# EAGLE design ext_board (EAGLE 7.4.0)
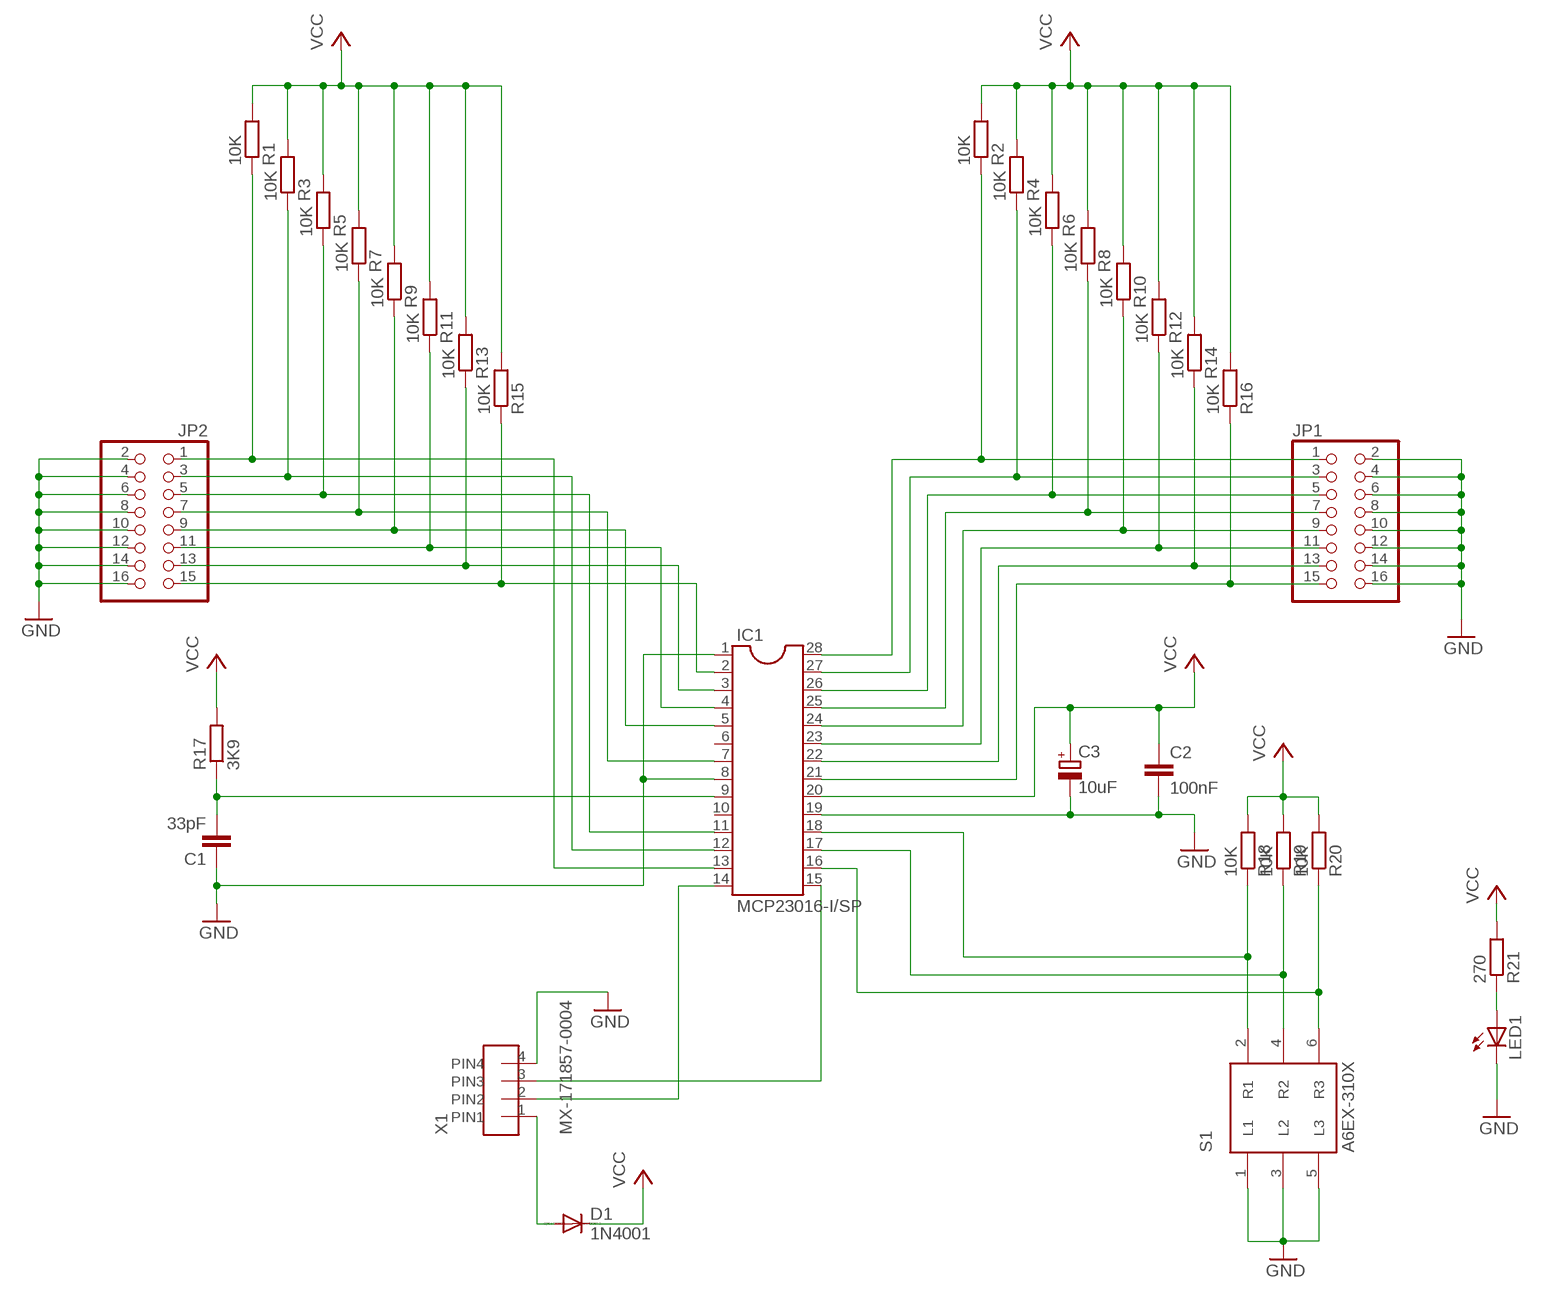
[diagram p0: schematic, sheet 1]

## Parts
C1  33pF  C-EU050-030X075  [C050-030X075]
C2  100nF  C-EU050-030X075  [C050-030X075]
C3  10uF  CPOL-EUE2.5-7  [E2,5-7]
D1  1N4001  1N4004  [DO41-10]
IC1  MCP23016-I/SP  DIL28-3  [DIL28-3]
JP1  PINHD-2X8  [2X08]
JP2  PINHD-2X8  [2X08]
LED1  LED3MM  [LED3MM]
R1  10K  R-EU_0204/7  [0204/7]
R2  10K  R-EU_0204/7  [0204/7]
R3  10K  R-EU_0204/7  [0204/7]
R4  10K  R-EU_0204/7  [0204/7]
R5  10K  R-EU_0204/7  [0204/7]
R6  10K  R-EU_0204/7  [0204/7]
R7  10K  R-EU_0204/7  [0204/7]
R8  10K  R-EU_0204/7  [0204/7]
R9  10K  R-EU_0204/7  [0204/7]
R10  10K  R-EU_0204/7  [0204/7]
R11  10K  R-EU_0204/7  [0204/7]
R12  10K  R-EU_0204/7  [0204/7]
R13  10K  R-EU_0204/7  [0204/7]
R14  10K  R-EU_0204/7  [0204/7]
R15  10K  R-EU_0204/7  [0204/7]
R16  10K  R-EU_0204/7  [0204/7]
R17  3K9  R-EU_0204/7  [0204/7]
R18  10K  R-EU_0204/7  [0204/7]
R19  10K  R-EU_0204/7  [0204/7]
R20  10K  R-EU_0204/7  [0204/7]
R21  270  R-EU_0204/7  [0204/7]
S1  A6EX-310X  [A6EX-310X]
X1  MX-171857-0004  [MX-171857-0004]

## Nets
GND: C1.1 C2.2 C3.- IC1.1 IC1.8 IC1.19 JP1.2 JP1.4 JP1.6 JP1.8 JP1.10 JP1.12 JP1.14 JP1.16 JP2.2 JP2.4 JP2.6 JP2.8 JP2.10 JP2.12 JP2.14 JP2.16 LED1.K(C) S1.1(L1) S1.3(L2) S1.5(L3) X1.4(PIN4)
GP0.0: IC1.21 JP1.15 R16.1
GP0.1: IC1.22 JP1.13 R14.1
GP0.2: IC1.23 JP1.11 R12.1
GP0.3: IC1.2 JP2.15 R15.1
GP0.4: IC1.3 JP2.13 R13.1
GP0.5: IC1.4 JP2.11 R11.1
N$1: C1.2 IC1.9 R17.1
N$2: IC1.18 R18.1 S1.2(R1)
N$3: IC1.17 R19.1 S1.4(R2)
N$4: IC1.5 JP2.9 R9.1
N$5: IC1.7 JP2.7 R7.1
N$6: D1.A X1.1(PIN1)
N$7: IC1.11 JP2.5 R5.1
N$11: IC1.16 R20.1 S1.6(R3)
N$13: IC1.24 JP1.9 R10.1
N$14: IC1.25 JP1.7 R8.1
N$15: IC1.26 JP1.5 R6.1
N$16: IC1.27 JP1.3 R4.1
N$17: IC1.28 JP1.1 R2.1
N$23: IC1.12 JP2.3 R3.1
N$24: IC1.13 JP2.1 R1.1
N$33: LED1.A R21.1
SCL: IC1.14 X1.2(PIN2)
SDA: IC1.15 X1.3(PIN3)
VCC: C2.1 C3.+ D1.C IC1.20 R1.2 R2.2 R3.2 R4.2 R5.2 R6.2 R7.2 R8.2 R9.2 R10.2 R11.2 R12.2 R13.2 R14.2 R15.2 R16.2 R17.2 R18.2 R19.2 R20.2 R21.2
Unconnected: IC1.6 IC1.10

## Library data of the parts
C1 = resistor:C-EU: CAPACITOR, European symbol; TME_CODE: FKP2-33P/1000-R
C2 = resistor:C-EU: CAPACITOR, European symbol; TME_CODE: CC-100N
C3 = rcl:CPOL-EU: POLARIZED CAPACITOR, European symbol; TME_CODE: UPW2A100MED
D1 = diode:1N4004: DIODE general purpose rectifier, 1 A; TME_CODE: 1N4001
IC1 = ic-package:DIL28: Dual In Line; TME_CODE: MCP23016-I/SP
JP1 JP2 = pinhead:PINHD-2X8: PIN HEADER; TME_CODE: 826632-8
LED1 = led:LED: LED OSRAM: - CHIPLED LG R971, LG N971, LY N971, LG Q971, LY Q971, LO R971, LY R971 LH N974, LH R974 LS Q976, LO Q976, LY Q976 LO Q996 - Hyper CHIPLED LW Q18S LB Q993, LB Q99A, LB R99A - SideLED LS A670, LO A670, LY A670, LG A670, LP A670 LB A673, LV A673, LT A673, LW A673 LH A674 LY A675 LS A676, LA A676, LO A676, LY A676, LW A676 LS A679, LY A679, LG A679 - Hyper Micro SIDELED® LS Y876, LA Y876, LO Y876, LY Y876 LT Y87S - SmartLED LW L88C, LW L88S LB L89C, LB L89S, LG L890 LS L89K, LO L89K, LY L89K LS L896, LA L896, LO L896, LY L896 - TOPLED LS T670, LO T670, LY T670, LG T670, LP T670 LSG T670, LSP T670, LSY T670, LOP T670, LYG T670 LG T671, LOG T671, LSG T671 LB T673, LV T673, LT T673, LW T673 LH T674 LS T676, LA T676, LO T676, LY T676, LB T676, LH T676, LSB T676, LW T676 LB T67C, LV T67C, LT T67C, LS T67K, LO T67K, LY T67K, LW E67C LS E67B, LA E67B, LO E67B, LY E67B, LB E67C, LV E67C, LT E67C LW T67C LS T679, LY T679, LG T679 LS T770, LO T770, LY T770, LG T770, LP T770 LB T773, LV T773, LT T773, LW T773 LH T774 LS E675, LA E675, LY E675, LS T675 LS T776, LA T776, LO T776, LY T776, LB T776 LHGB T686 LT T68C, LB T68C - Hyper Mini TOPLED® LB M676 - Mini TOPLED Santana® LG M470 LS M47K, LO M47K, LY M47K Source: http://www.osram.convergy.de LUXEON: - LUMILED® LXK2-PW12-R00, LXK2-PW12-S00, LXK2-PW14-U00, LXK2-PW14-V00 LXK2-PM12-R00, LXK2-PM12-S00, LXK2-PM14-U00 LXK2-PE12-Q00, LXK2-PE12-R00, LXK2-PE12-S00, LXK2-PE14-T00, LXK2-PE14-U00 LXK2-PB12-K00, LXK2-PB12-L00, LXK2-PB12-M00, LXK2-PB14-N00, LXK2-PB14-P00, LXK2-PB14-Q00 LXK2-PR12-L00, LXK2-PR12-M00, LXK2-PR14-Q00, LXK2-PR14-R00 LXK2-PD12-Q00, LXK2-PD12-R00, LXK2-PD12-S00 LXK2-PH12-R00, LXK2-PH12-S00 LXK2-PL12-P00, LXK2-PL12-Q00, LXK2-PL12-R00 Source: www.luxeon.com KINGBRIGHT: KA-3528ASYC Source: www.kingbright.com; TME_CODE: L-934ID
R1-R16 R18-R20 = resistor:R-EU_: RESISTOR, European symbol; TME_CODE: CF1/2WS-10K
R17 = resistor:R-EU_: RESISTOR, European symbol; TME_CODE: 1/4W3.9K
R21 = resistor:R-EU_: RESISTOR, European symbol; TME_CODE: CF1/2WS-270R
S1 = omron_dip_switch:A6EX-310X: OMRON Slide/Piano DIP Switch DIP Switch with a variety of assortment of Poles and Actuators in Slide or Piano Types. Source: http://www.tme.eu/en/Document/c2660313fae264cf6ac8383102742e6d/A6E_A6ER.PDF; TME_CODE: A6E-3104
X1 = con-molex-mx:MX-171857-0004; TME_CODE: MX-7395-04B

## Board
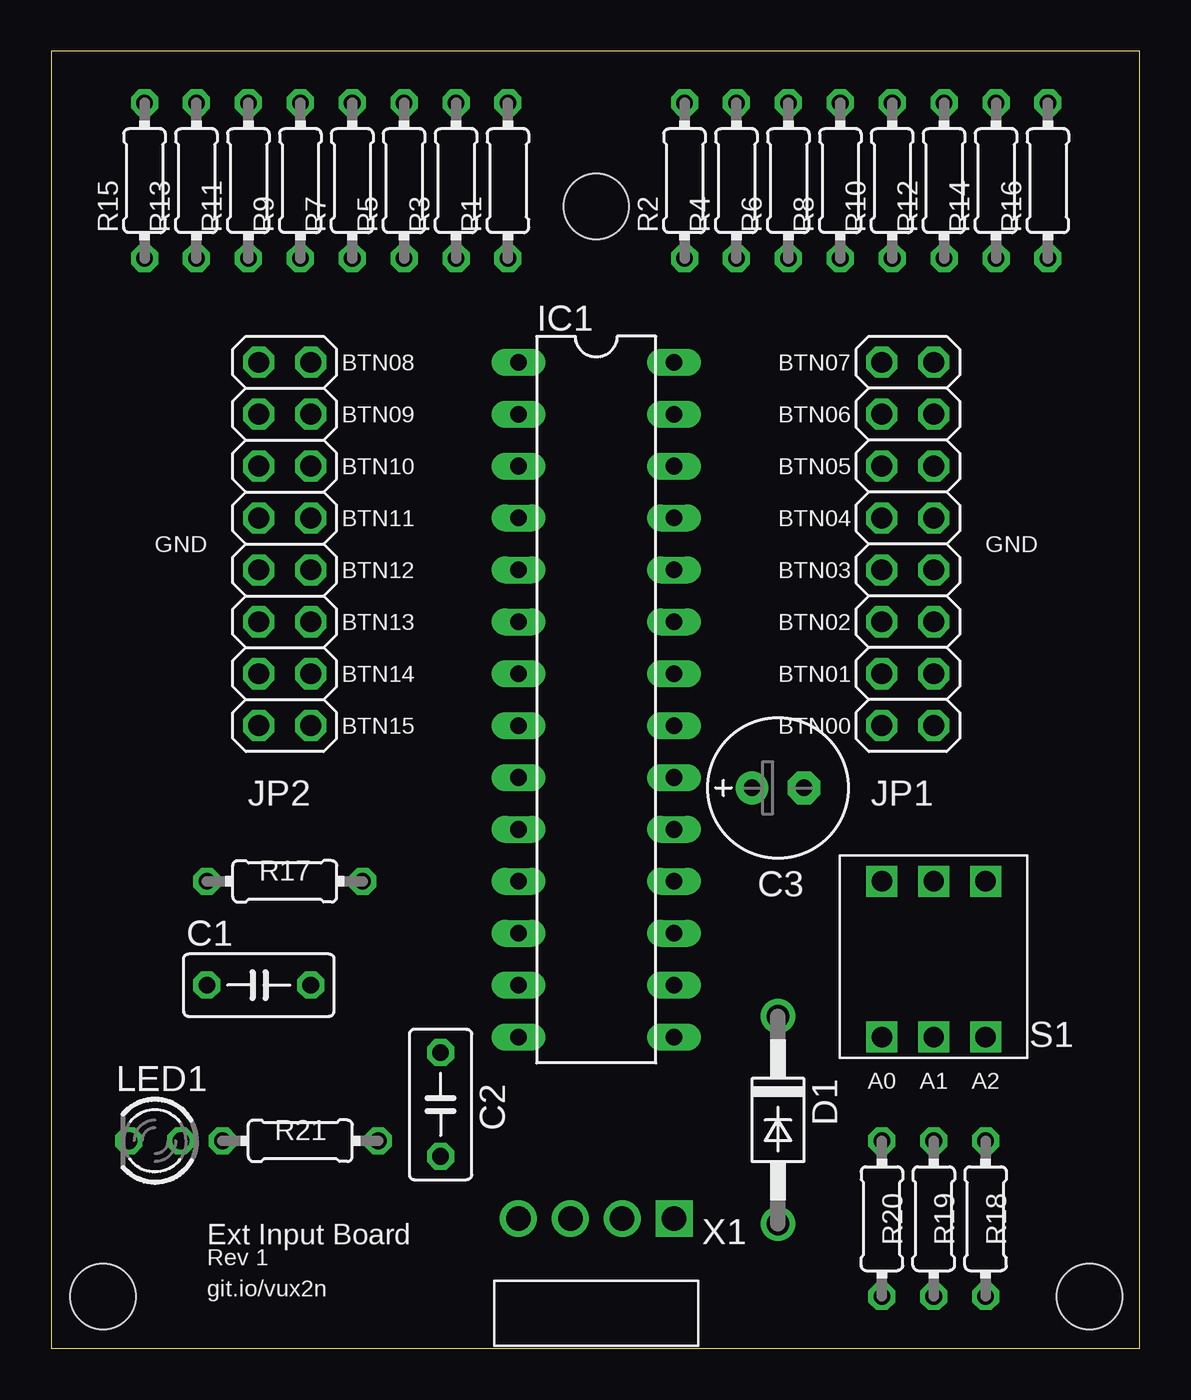
[diagram p1: board, top side]
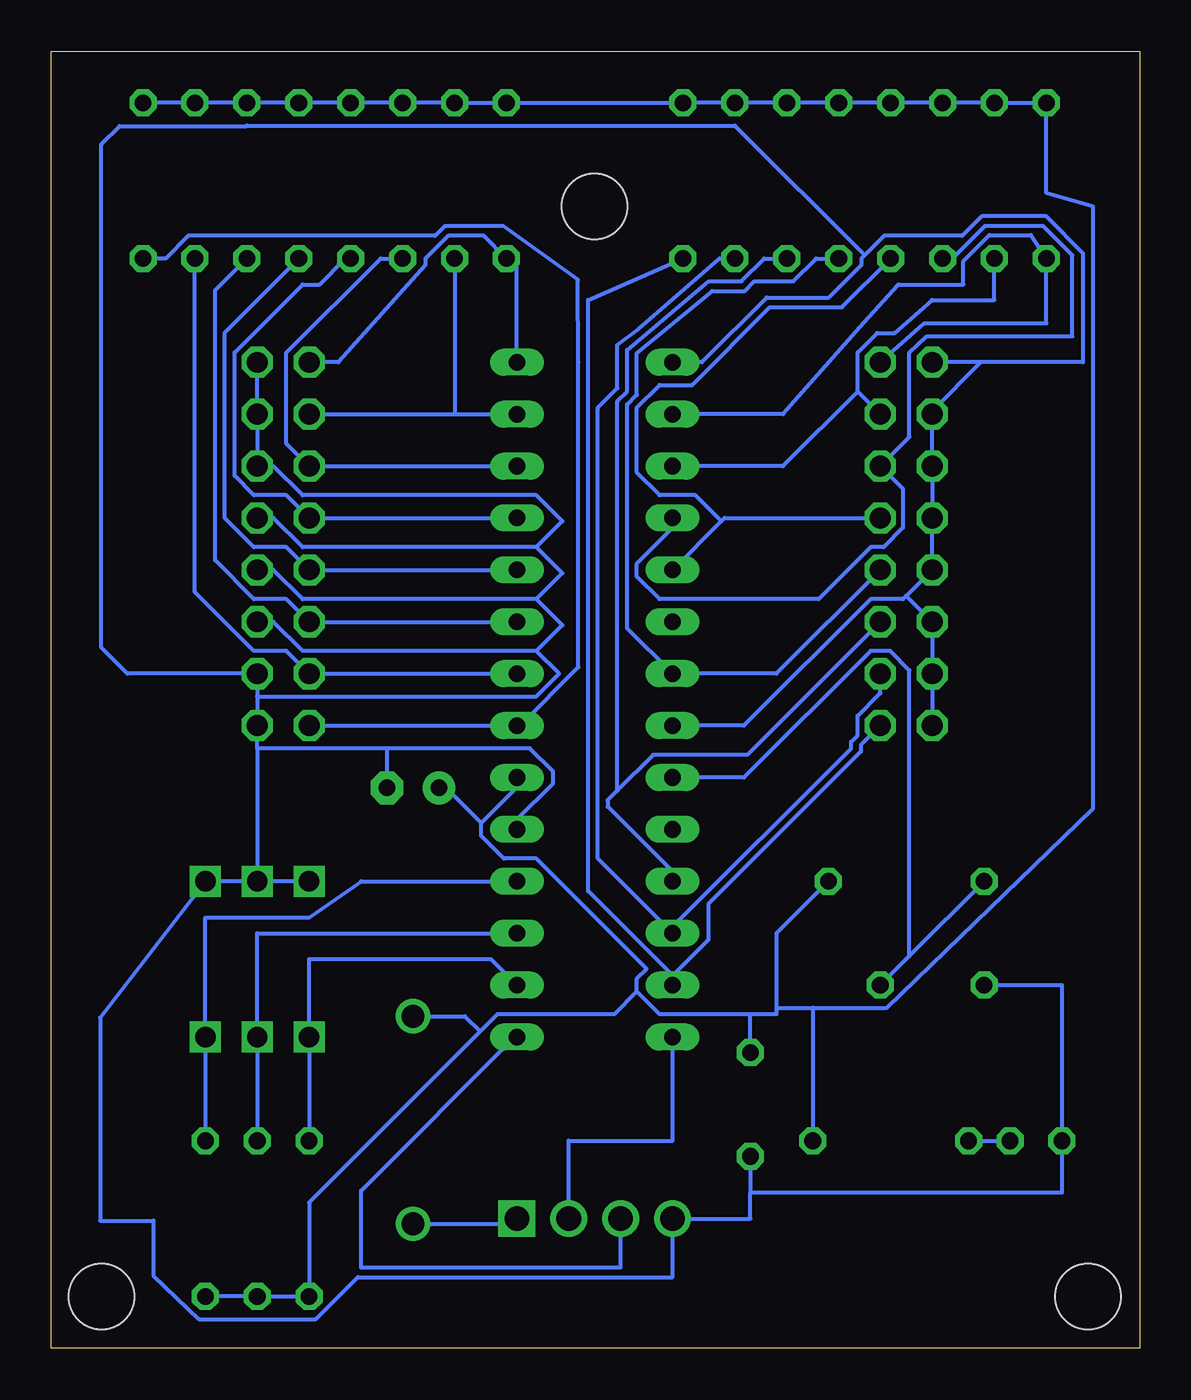
[diagram p2: board, bottom side, seen from below]

Size 53.26 x 63.49 mm. Coordinates in mm from the lower left corner, seen from the top.
Outline: 0,0 53.26,0 53.26,63.49 0,63.49 0,0
Copper layers (1*16): Top 0.035mm / dielectric 1.5mm / Bottom 0.035mm
Design rules "drukowane.pl": minimum track width 8mil, minimum drill 0.4mm, track to track 8mil, track to pad 8mil, pad to pad 8mil, via to via 8mil, smd to smd 8mil, copper to edge 40mil, drill to drill 8mil, minimum pad ring 10mil, minimum via ring 8mil, stop-mask expansion 4mil, vias tented up to drill 0mil, thermal gap 10mil
Holes 3.2 mm at 2.54,2.54 50.8,2.54 26.67,55.88

### Footprints (pad centres in the part's own frame; a part is rotated, then mirrored left to right if it is on the bottom)
C050-030X075 = drill 0.813 octagon: 1 -2.54,0; 2 2.54,0
E2,5-7 = drill 0.813 pad 1.6: + -1.27,0 | drill 0.813 pad 1.6 octagon: - 1.27,0
DO41-10 = drill 1.118: A 5.08,0; C -5.08,0
DIL28-3 = drill 0.813 long: 1 -16.51,-3.81; 2 -13.97,-3.81; 3 -11.43,-3.81; 4 -8.89,-3.81; 5 -6.35,-3.81; 6 -3.81,-3.81; 7 -1.27,-3.81; 8 1.27,-3.81; 9 3.81,-3.81; 10 6.35,-3.81; 11 8.89,-3.81; 12 11.43,-3.81; 13 13.97,-3.81; 14 16.51,-3.81; 15 16.51,3.81; 16 13.97,3.81; 17 11.43,3.81; 18 8.89,3.81; 19 6.35,3.81; 20 3.81,3.81; 21 1.27,3.81; 22 -1.27,3.81; 23 -3.81,3.81; 24 -6.35,3.81; 25 -8.89,3.81; 26 -11.43,3.81; 27 -13.97,3.81; 28 -16.51,3.81
2X08 = drill 1.016 octagon: 1 -8.89,-1.27; 2 -8.89,1.27; 3 -6.35,-1.27; 4 -6.35,1.27; 5 -3.81,-1.27; 6 -3.81,1.27; 7 -1.27,-1.27; 8 -1.27,1.27; 9 1.27,-1.27; 10 1.27,1.27; 11 3.81,-1.27; 12 3.81,1.27; 13 6.35,-1.27; 14 6.35,1.27; 15 8.89,-1.27; 16 8.89,1.27
LED3MM = drill 0.813 octagon: A -1.27,0; K 1.27,0
0204/7 = drill 0.813 octagon: 1 -3.81,0; 2 3.81,0
A6EX-310X = drill 1 square: 1 0,0; 2 0,7.62; 3 2.54,0; 4 2.54,7.62; 5 5.08,0; 6 5.08,7.62
MX-171857-0004 = drill 1.2 square: 1 0,0 | drill 1.2: 2 2.54,0; 3 5.08,0; 4 7.62,0

### Placement (x,y rotation side)
C1  10.16,17.78 0 top
C2  19.05,11.94 270 top
C3  35.56,27.43 0 top
D1  35.56,11.18 270 top
IC1  26.67,31.75 270 top
JP1  41.91,39.37 270 top
JP2  11.43,39.37 90 top
LED1  5.08,10.16 180 top
R1  22.35,57.15 90 top
R2  30.99,57.15 90 top
R3  19.81,57.15 90 top
R4  33.53,57.15 90 top
R5  17.27,57.15 90 top
R6  36.07,57.15 90 top
R7  14.73,57.15 90 top
R8  38.61,57.15 90 top
R9  12.19,57.15 90 top
R10  41.15,57.15 90 top
R11  9.65,57.15 90 top
R12  43.69,57.15 90 top
R13  7.11,57.15 90 top
R14  46.23,57.15 90 top
R15  4.57,57.15 90 top
R16  48.77,57.15 90 top
R17  11.43,22.86 0 top
R18  45.72,6.35 270 top
R19  43.18,6.35 270 top
R20  40.64,6.35 270 top
R21  12.19,10.16 0 top
S1  45.72,22.86 180 top
X1  30.48,6.35 180 top

### Tracks (layer width: path | path; a pad name or v marks a point on that pad's centre or on a via)
GND
  Bottom 0.203: IC1.1 21.43,48.26 18.26,51.44 15.21,51.44 13.62,53.02 13.62,53.34 13.46,53.5 | 13.46,53.5 12.51,54.45 8.7,54.45 7.75,55.4 4.57,55.4 2.79,53.59 2.79,48.26 7.78,48.26 | 7.78,48.26 10.16,45.88 JP2.14 JP2.12 JP2.10 JP2.8 11.43,36.83 | 7.78,48.26 JP2.16 | JP2.2 JP2.4 JP2.6 11.43,36.83 | IC1.8 19.37,30.48 13.18,36.67 11.59,36.67 11.43,36.83 | C1.1 3.81,17.78 LED1.K 3.81,7.62 19.05,7.62 | S1.5 S1.3 | S1.3 S1.1 50.86,16.19 50.86,6.25 48.26,6.25 48.26,3.56 46.04,1.43 40.32,1.43 38.26,3.49 22.86,3.49 X1.4 19.05,6.35 19.05,7.62 | JP1.2 JP1.4 JP1.6 42.39,43.18 40.96,41.75 29.53,41.75 28.26,40.48 29.53,39.21 | 43.18,31.91 JP1.14 49.53,33.02 50.8,34.29 50.8,58.93 49.91,59.82 43.72,59.82 43.69,59.85 19.81,59.85 13.46,53.5 | 43.18,31.91 JP1.16 43.18,29.37 | JP1.12 42.39,35.56 40.96,34.13 29.53,34.13 | 29.53,34.13 28.42,33.02 29.53,31.91 43.18,31.91 | JP1.10 42.39,38.1 40.96,36.67 29.53,36.67 | 29.53,36.67 28.26,35.4 29.53,34.13 | JP1.8 42.39,40.64 40.96,39.21 29.53,39.21 | 29.53,39.21 28.26,37.94 29.53,36.67 | 36.83,29.37 29.84,29.37 28.73,28.26 28.73,27.62 30.48,25.88 IC1.19 | 36.83,29.37 43.18,29.37 | 43.18,29.37 S1.3 | C2.2 19.05,7.62 | C3.- 36.83,29.37
GP0.0
  Bottom 0.203: JP1.15 IC1.21 30.32,30.48 27.46,33.34 27.46,48.26 27.5,52.29 31.15,54.93 34,54.93 34.48,54.45 46.55,54.45 47.66,53.34 R16.1
GP0.1
  Bottom 0.203: IC1.22 JP1.13 41.75,34.13 43.34,34.13 46.23,37.02 R14.1
GP0.2
  Bottom 0.203: IC1.23 JP1.11 41.75,36.67 43.34,36.67 45.24,38.58 45.24,51.78 R12.1
GP0.3
  Bottom 0.203: IC1.2 17.46,45.72 13.72,49.97 11.81,52.07 8.64,52.07 8.64,53.21 7.37,54.48 5.33,54.48 R15.1 4.57,50.16 10.54,50.16 JP2.15
GP0.4
  Bottom 0.203: 13.81,46.83 13.81,48.74 12.86,49.69 12,49.69 10.16,51.31 7.11,51.31 R13.1 | JP2.13 13.81,46.83 | IC1.3 17.46,43.18 13.81,46.83
GP0.5
  Bottom 0.203: IC1.4 22.86,40.16 24.61,38.42 24.61,37.78 23.5,36.67 15.72,36.67 13.18,39.21 12.54,39.21 11.59,40.16 11.59,42.07 JP2.11 11.27,44.61 11.27,48.74 10.41,49.53 3.3,49.53 3.3,53.5 4.73,54.93 7.59,54.93 9.18,53.34 R11.1
N$1
  Bottom 0.203: C1.2 11.27,19.21 | 11.27,19.21 R17.1 | IC1.9 19.37,27.94 13.18,34.13 12.22,34.13 11.27,33.18 11.27,19.21
N$2
  Bottom 0.203: IC1.18 38.1,22.86 40.64,21.08 45.72,21.08 S1.2 R18.1
N$3
  Bottom 0.203: R19.1 S1.4 43.18,20.32 IC1.17
N$4
  Bottom 0.203: 20.48,40.48 21.75,41.75 23.5,41.75 24.61,42.86 24.61,46.04 23.5,47.15 21.91,47.15 18.1,50.96 14.57,50.96 R9.1 | IC1.5 20.48,40.48 | JP2.9 20.32,40.64 20.48,40.48
N$5
  Bottom 0.203: JP2.7 17.78,33.02 IC1.7 25.08,35.24 25.08,46.2 24.61,46.67 24.61,48.7 20.92,51.75 19.34,51.75 18.86,52.23 16.95,52.23 15.84,53.34 R7.1
N$6
  Bottom 0.203: D1.A 30.48,6.1 X1.1
N$7
  Bottom 0.203: IC1.11 22.86,23.34 26.04,26.51 26.04,26.83 25.56,27.3 | 25.56,27.3 23.81,29.05 19.21,29.05 JP2.5 | R5.1 18.38,53.34 19.49,52.23 21.08,52.23 25.08,48.86 25.08,46.83 25.56,46.35 25.56,27.3
N$11
  Bottom 0.203: R20.1 S1.6 40.64,19.05 31.75,19.05 IC1.16
N$13
  Bottom 0.203: IC1.24 JP1.9 41.75,39.21 43.34,39.21 44.77,40.64 44.77,49.72 R10.1
N$14
  Bottom 0.203: IC1.25 JP1.7 41.75,41.75 43.34,41.75 44.29,42.7 44.29,48.74 40.96,52.07 40.13,52.07 38.86,53.34 R8.1
N$15
  Bottom 0.203: IC1.26 JP1.5 41.75,44.29 41.75,48.74 37.15,53.34 R6.1
N$16
  Bottom 0.203: JP1.3 IC1.27 33.53,45.72 R4.1
N$17
  Bottom 0.203: JP1.1 39.21,48.26 34.96,53.02 34.96,53.34 33.85,54.45 32.1,54.45 R2.1 30.48,53.34 IC1.28
N$23
  Bottom 0.203: 23.02,20.48 26.51,23.97 26.51,46.04 25.56,46.99 25.56,49.12 24.51,49.91 20.57,53.34 R3.1 | JP2.3 12.7,32.07 13.81,30.96 13.81,30 14.13,29.69 14.13,29.37 23.02,20.48 | 23.02,20.48 IC1.12
N$24
  Bottom 0.203: 22.86,18.26 21.11,20 21.11,21.75 13.65,29.21 13.65,29.53 JP2.1 | 22.86,18.26 26.99,22.38 26.99,51.31 R1.1 | 22.86,18.26 IC1.13
N$33
  Bottom 0.203: R21.1 LED1.A
SCL
  Bottom 0.203: X1.2 27.94,10.16 22.86,10.16 IC1.14
SDA
  Bottom 0.203: IC1.15 30.57,15.24 38.1,7.71 38.1,3.97 25.4,3.97 X1.3
VCC
  Bottom 0.203: R16.2 R14.2 R12.2 R10.2 R8.2 R6.2 R4.2 R2.2 R1.2 R3.2 R5.2 R7.2 R9.2 R11.2 R13.2 R15.2 4.57,56.55 2.29,55.88 2.29,26.42 12.38,16.67 16,16.67 | R18.2 R19.2 R20.2 40.64,7.14 32.27,15.51 | 17.78,16.67 17.78,20.32 R17.2 | 16,16.67 R21.2 | 32.23,25.72 30.48,27.46 IC1.20 | 32.23,25.72 32.23,25.08 31.11,23.97 29.53,23.97 24.13,18.57 24.61,18.1 24.61,17.46 | 24.61,17.46 23.5,16.35 19.05,16.35 | 19.05,16.35 17.78,16.35 17.78,16.67 | 32.27,15.51 31.43,16.35 25.72,16.35 24.61,17.46 | 17.78,16.67 16,16.67 | C2.1 19.05,16.35 | D1.C 33.02,16.26 32.27,15.51 | C3.+ 33.94,27.43 32.23,25.72

### Text on the board
tPlace: BTN08 | BTN07 | BTN09 | BTN06 | BTN10 | BTN05 | BTN11 | BTN04 | GND | GND | BTN12 | BTN03 | BTN13 | BTN02 | BTN14 | BTN01 | BTN15 | BTN00 | A0 | A1 | A2 | Ext Input Board | Rev 1 | git.io/vux2n